# EAGLE design quad_ctl_094 (EAGLE 4.16)

## Sheet 1 of 2
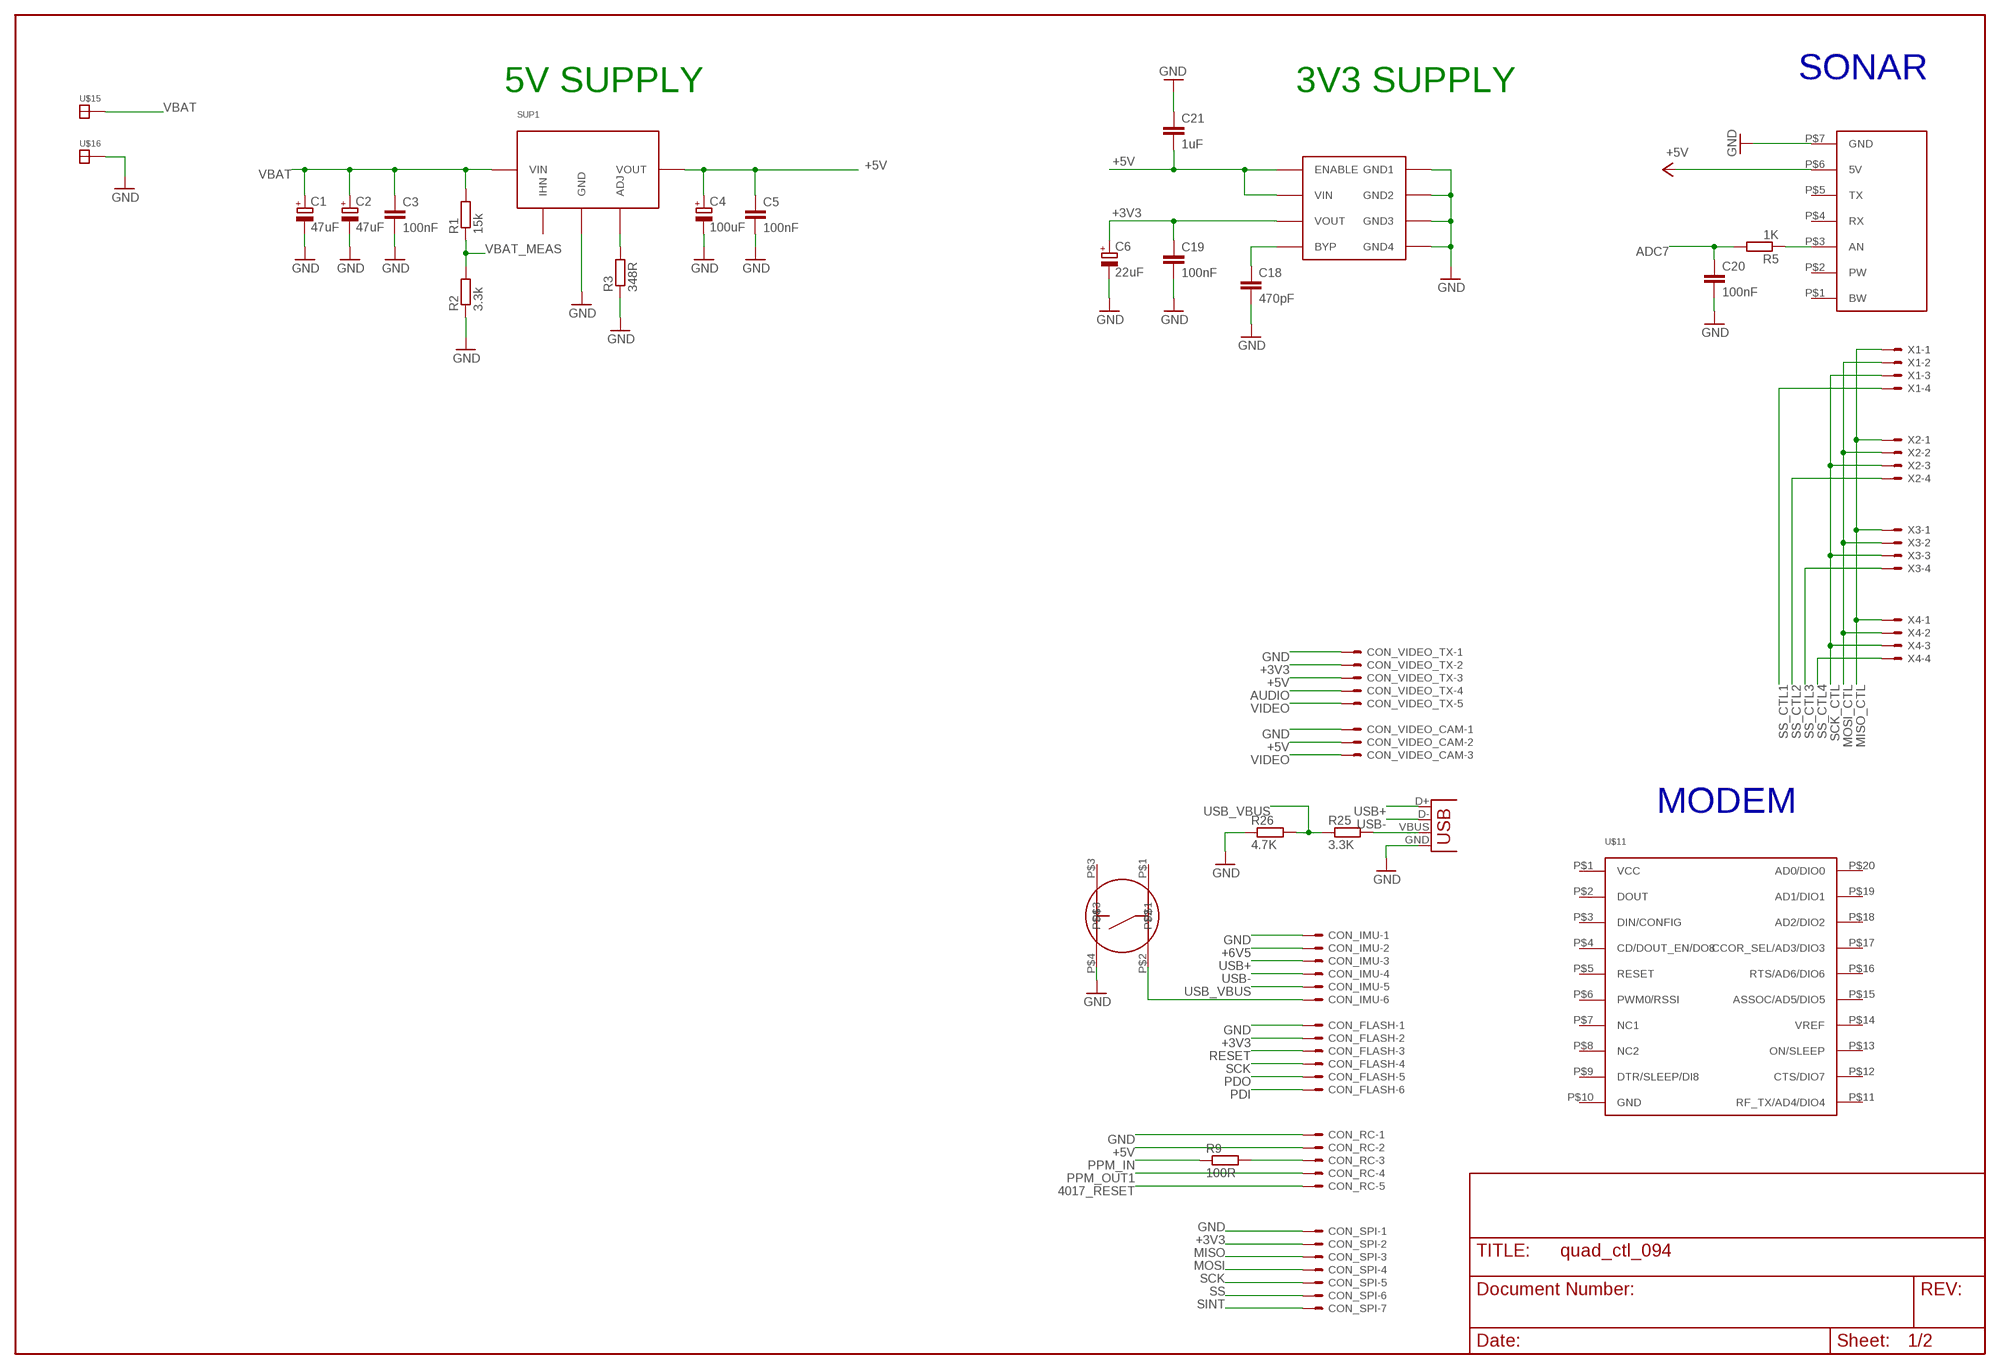
[diagram p0: schematic, sheet 1]

### Parts
C1  47uF  CPOL-EUSMCD  [SMC_D]
C2  47uF  CPOL-EUSMCD  [SMC_D]
C3  100nF  C-EUC0402K  [C0402K]
C4  100uF  CPOL-EUSMCD  [SMC_D]
C5  100nF  C-EUC0402K  [C0402K]
C6  22uF  CPOL-EUSMCB  [SMC_B]
C18  470pF  C-EUC0402K  [C0402K]
C19  100nF  C-EUC0402K  [C0402K]
C20  100nF  C-EUC0603  [C0603]
C21  1uF  C-EUC0805K  [C0805K]
CON_FLASH  53047-06  [53047-06]
CON_IMU  53047-06  [53047-06]
CON_RC  53047-05  [53047-05]
CON_SPI  53047-07  [53047-07]
CON_VIDEO_CAM  53047-03  [53047-03]
CON_VIDEO_TX  53047-05  [53047-05]
R1  15k  R-EU_R0402  [R0402]
R2  3.3k  R-EU_R0402  [R0402]
R3  348R  R-EU_R0402  [R0402]
R5  1K  R-EU_R0603  [R0603]
R9  100R  R-EU_R0603  [R0603]
R25  3.3K  R-EU_R0603  [R0603]
R26  4.7K  R-EU_R0603  [R0603]
SUP1  PTH  [PTH]
U$1  B3S  [B3S]
U$4  MIC5209  [SOIC8]
U$9  MAXSONAR  [MAXSONAR]
U$11  XBEEPRO  [XBEE]
U$15  SOLDER_PAD150_75  [SOLD_PAD_150_75]
U$16  SOLDER_PAD150_75  [SOLD_PAD_150_75]
X1  53047-04  [53047-04]
X2  53047-04  [53047-04]
X3  53047-04  [53047-04]
X4  53047-04  [53047-04]
X12  USB-MB-S  [USB-MB-S]

### Nets
4017_RESET: CON_RC.5
+3V3: C6.+ C19.1 CON_FLASH.2 CON_SPI.2 CON_VIDEO_TX.2 U$4.3(VOUT)
+5V: C4.+ C5.1 C21.2 CON_RC.2 CON_VIDEO_CAM.2 CON_VIDEO_TX.3 SUP1.P$3(VOUT) U$4.1(ENABLE) U$4.2(VIN) U$9.P$6(5V)
+6V5: CON_IMU.2
ADC7: C20.1 R5.2
AUDIO: CON_VIDEO_TX.4
GND: C1.- C2.- C3.2 C4.- C5.2 C6.- C18.2 C19.2 C20.2 C21.1 CON_FLASH.1 CON_IMU.1 CON_RC.1 CON_SPI.1 CON_VIDEO_CAM.1 CON_VIDEO_TX.1 R2.1 R3.1 R26.1 SUP1.P$2(GND) U$1.P$4 U$4.5(GND4) U$4.6(GND3) U$4.7(GND2) U$4.8(GND1) U$9.P$7(GND) U$16.P$1 X12.GND
MISO: CON_SPI.3
MISO_CTL: X1.1 X2.1 X3.1 X4.1
MOSI: CON_SPI.4
MOSI_CTL: X1.2 X2.2 X3.2 X4.2
N$5: R3.2 SUP1.P$4(ADJ)
N$6: C18.1 U$4.4(BYP)
N$7: CON_RC.3 R9.2
N$8: CON_IMU.6 U$1.P$2
N$24: R25.2 X12.VBUS
N$36: R5.1 U$9.P$3(AN)
PDI: CON_FLASH.6
PDO: CON_FLASH.5
PPM_IN: R9.1
PPM_OUT1: CON_RC.4
RESET: CON_FLASH.3
SCK: CON_FLASH.4 CON_SPI.5
SCK_CTL: X1.3 X2.3 X3.3 X4.3
SINT: CON_SPI.7
SS: CON_SPI.6
SS_CTL1: X1.4
SS_CTL2: X2.4
SS_CTL3: X3.4
SS_CTL4: X4.4
USB+: CON_IMU.3 X12.D+
USB-: CON_IMU.4 X12.D-
USB_VBUS: CON_IMU.5 R25.1 R26.2
VBAT: C1.+ C2.+ C3.1 R1.2 SUP1.P$1(VIN) U$15.P$1
VBAT_MEAS: R1.1 R2.2
VIDEO: CON_VIDEO_CAM.3 CON_VIDEO_TX.5
Unconnected: SUP1.P$5(IHN) U$1.P$1 U$1.P$3 U$9.P$1(BW) U$9.P$2(PW) U$9.P$4(RX) U$9.P$5(TX) U$11.P$1(VCC) U$11.P$2(DOUT) U$11.P$3(DIN/CONFIG) U$11.P$4(CD/DOUT_EN/DO8) U$11.P$5(RESET) U$11.P$6(PWM0/RSSI) U$11.P$7(NC1) U$11.P$8(NC2) U$11.P$9(DTR/SLEEP/DI8) U$11.P$10(GND) U$11.P$11(RF_TX/AD4/DIO4) U$11.P$12(CTS/DIO7) U$11.P$13(ON/SLEEP) U$11.P$14(VREF) U$11.P$15(ASSOC/AD5/DIO5) U$11.P$16(RTS/AD6/DIO6) U$11.P$17(CCOR_SEL/AD3/DIO3) U$11.P$18(AD2/DIO2) U$11.P$19(AD1/DIO1) U$11.P$20(AD0/DIO0)

### Notes on the sheet
- SONAR
- 5V SUPPLY | 3V3 SUPPLY
- MODEM

## Sheet 2 of 2
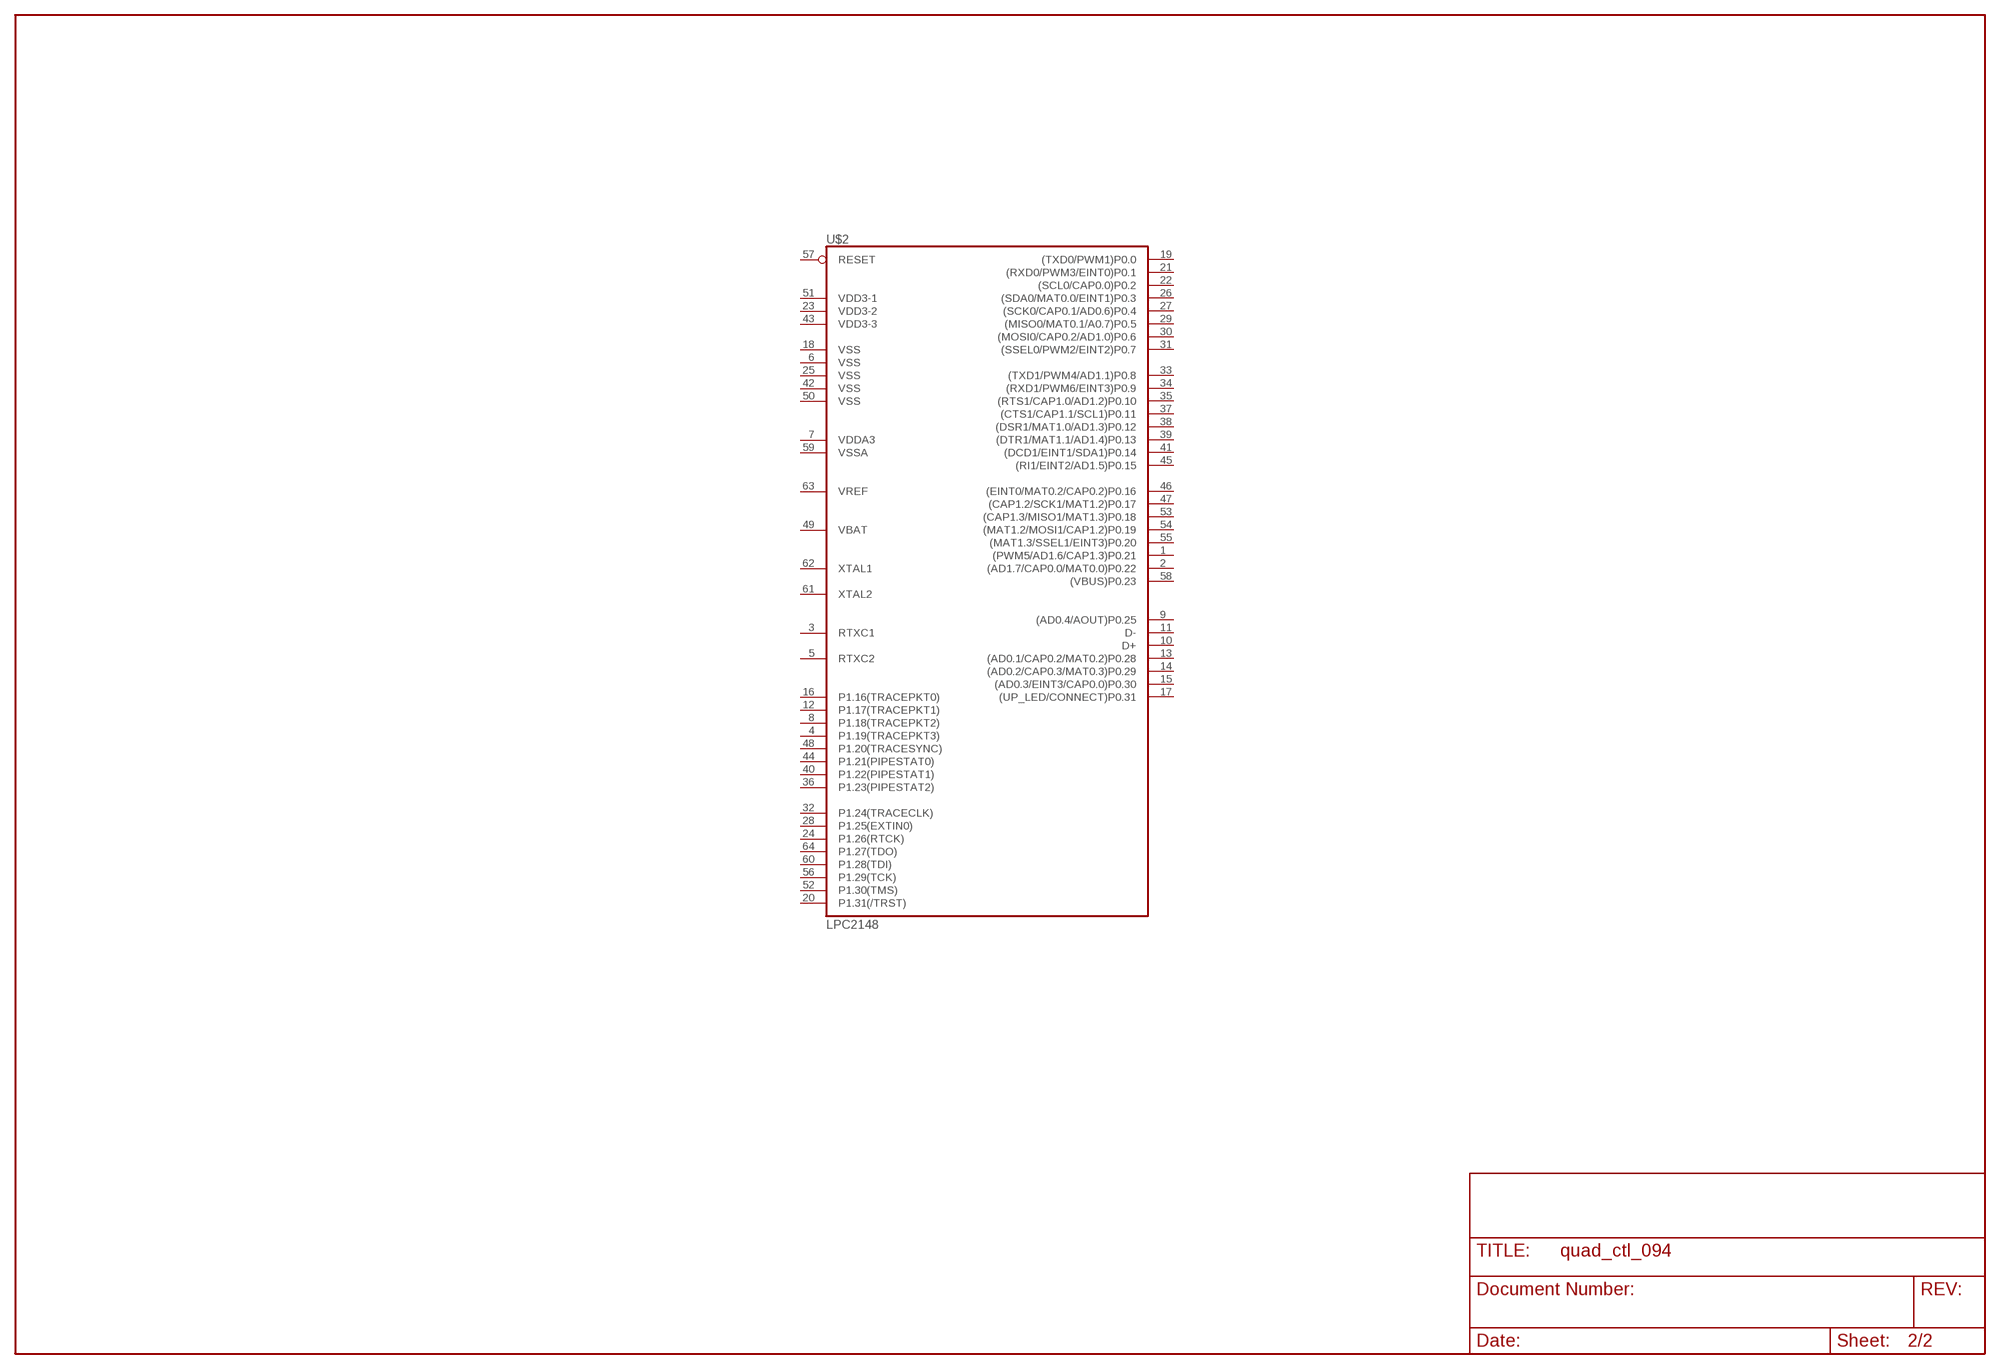
[diagram p1: schematic, sheet 2]

### Parts
U$2  LPC2148  [SQFP-S-10X10-64]
Unconnected: U$2.1((PWM5/AD1.6/CAP1.3)P0.21) U$2.2((AD1.7/CAP0.0/MAT0.0)P0.22) U$2.3(RTXC1) U$2.4(P1.19(TRACEPKT3)) U$2.5(RTXC2) U$2.8(P1.18(TRACEPKT2)) U$2.9((AD0.4/AOUT)P0.25) U$2.10(D+) U$2.11(D-) U$2.12(P1.17(TRACEPKT1)) U$2.13((AD0.1/CAP0.2/MAT0.2)P0.28) U$2.14((AD0.2/CAP0.3/MAT0.3)P0.29) U$2.15((AD0.3/EINT3/CAP0.0)P0.30) U$2.16(P1.16(TRACEPKT0)) U$2.17((UP_LED/CONNECT)P0.31) U$2.19((TXD0/PWM1)P0.0) U$2.20(P1.31(/TRST)) U$2.21((RXD0/PWM3/EINT0)P0.1) U$2.22((SCL0/CAP0.0)P0.2) U$2.24(P1.26(RTCK)) U$2.26((SDA0/MAT0.0/EINT1)P0.3) U$2.27((SCK0/CAP0.1/AD0.6)P0.4) U$2.28(P1.25(EXTIN0)) U$2.29((MISO0/MAT0.1/A0.7)P0.5) U$2.30((MOSI0/CAP0.2/AD1.0)P0.6) U$2.31((SSEL0/PWM2/EINT2)P0.7) U$2.32(P1.24(TRACECLK)) U$2.33((TXD1/PWM4/AD1.1)P0.8) U$2.34((RXD1/PWM6/EINT3)P0.9) U$2.35((RTS1/CAP1.0/AD1.2)P0.10) U$2.36(P1.23(PIPESTAT2)) U$2.37((CTS1/CAP1.1/SCL1)P0.11) U$2.38((DSR1/MAT1.0/AD1.3)P0.12) U$2.39((DTR1/MAT1.1/AD1.4)P0.13) U$2.40(P1.22(PIPESTAT1)) U$2.41((DCD1/EINT1/SDA1)P0.14) U$2.44(P1.21(PIPESTAT0)) U$2.45((RI1/EINT2/AD1.5)P0.15) U$2.46((EINT0/MAT0.2/CAP0.2)P0.16) U$2.47((CAP1.2/SCK1/MAT1.2)P0.17) U$2.48(P1.20(TRACESYNC)) U$2.52(P1.30(TMS)) U$2.53((CAP1.3/MISO1/MAT1.3)P0.18) U$2.54((MAT1.2/MOSI1/CAP1.2)P0.19) U$2.55((MAT1.3/SSEL1/EINT3)P0.20) U$2.56(P1.29(TCK)) U$2.57(RESET) U$2.58((VBUS)P0.23) U$2.60(P1.28(TDI)) U$2.61(XTAL2) U$2.62(XTAL1) U$2.63(VREF) U$2.64(P1.27(TDO))

## Power pins joined to a net without a drawn wire
VBAT: U$2.49(VBAT)
VDD3-1: U$2.51(VDD3-1)
VDD3-2: U$2.23(VDD3-2)
VDD3-3: U$2.43(VDD3-3)
VDDA3: U$2.7(VDDA3)
VSS: U$2.6(VSS) U$2.18(VSS) U$2.25(VSS) U$2.42(VSS) U$2.50(VSS)
VSSA: U$2.59(VSSA)

## Library data of the parts
C1 C2 C4 C6 = rcl:CPOL-EU: POLARIZED CAPACITOR, European symbol
C3 C5 C18-C21 = rcl:C-EU: CAPACITOR, European symbol
CON_FLASH CON_IMU = con-molex:53?-06: CONNECTOR wire to board 1.25 mm (.049 inch) pitch header
CON_RC CON_VIDEO_TX = con-molex:53?-05: CONNECTOR wire to board 1.25 mm (.049 inch) pitch header
CON_SPI = con-molex:53?-07: CONNECTOR wire to board 1.25 mm (.049 inch) pitch header
CON_VIDEO_CAM = con-molex:53?-03: CONNECTOR wire to board 1.25 mm (.049 inch) pitch header
R1-R3 R5 R9 R25 R26 = rcl:R-EU_: RESISTOR, European symbol
SUP1 = paparazzi:PTH
U$1 = paparazzi:B3S
U$2 = paparazzi:LPC2148
U$4 = paparazzi:MIC5209
U$9 = paparazzi:MAXSONAR
U$11 = paparazzi:XBEEPRO
U$15 U$16 = paparazzi:SOLDER_PAD
X1-X4 = con-molex:53?-04: CONNECTOR wire to board 1.25 mm (.049 inch) pitch header
X12 = con-usb:USB: USB Connectors

## Board
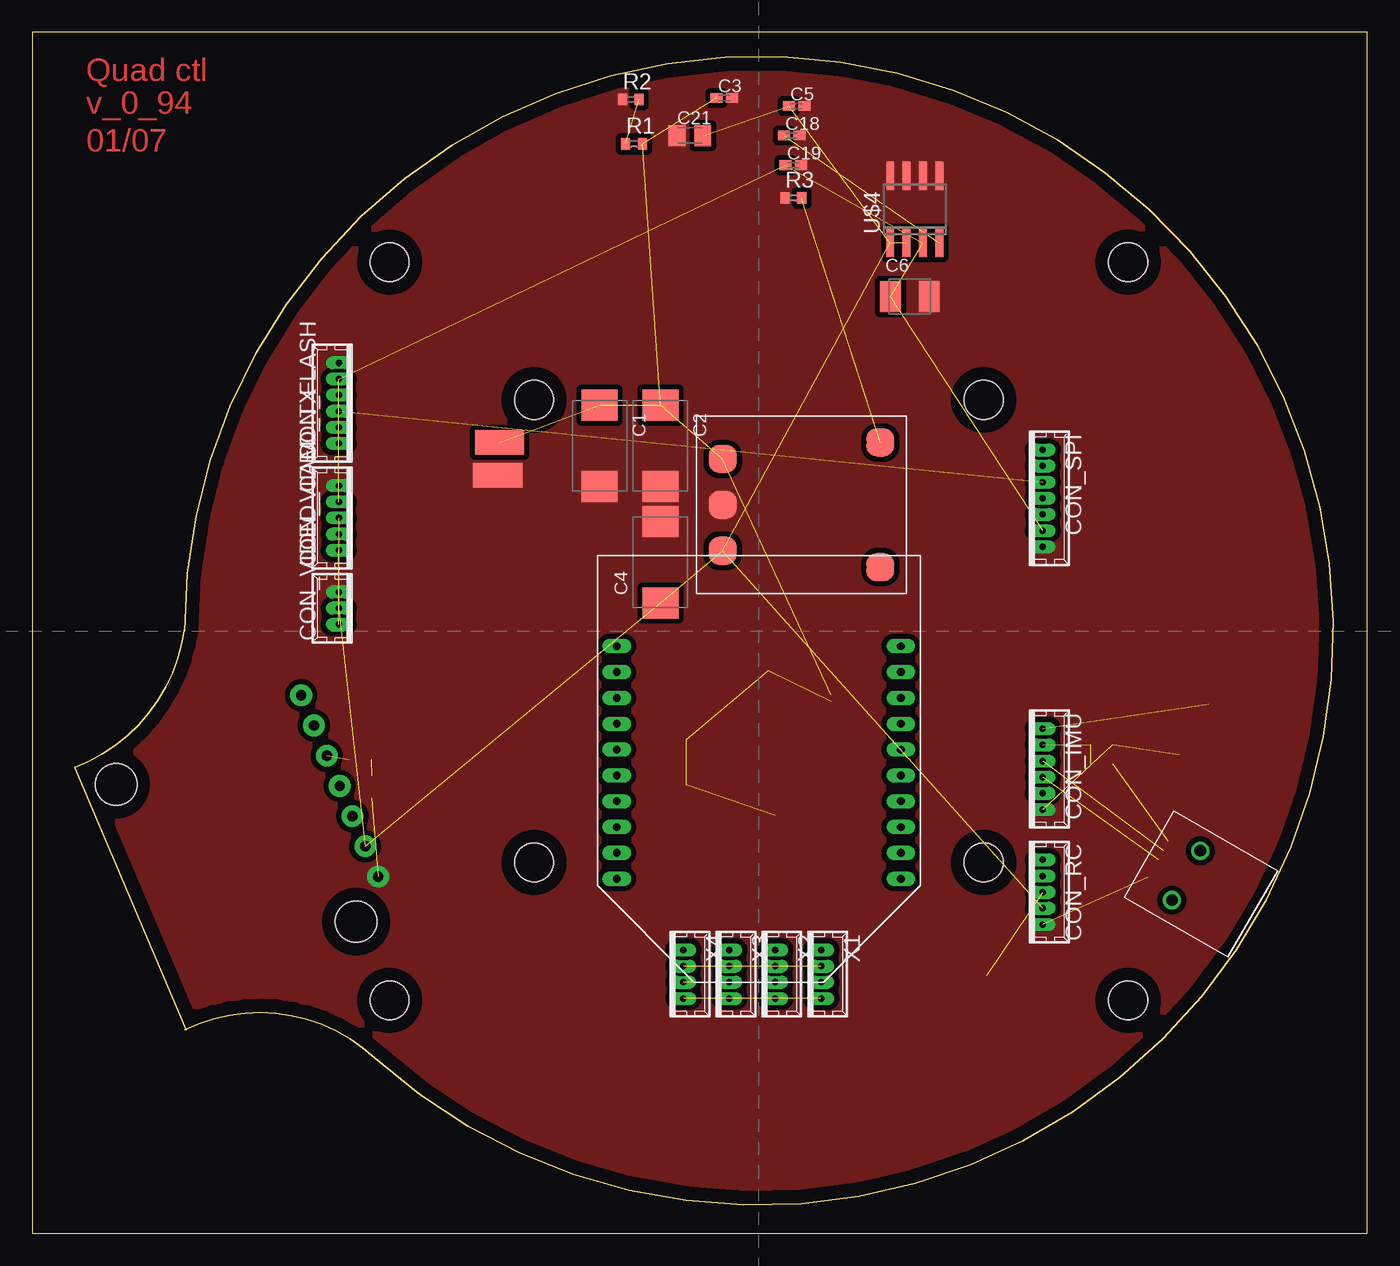
[diagram p2: board, top side]
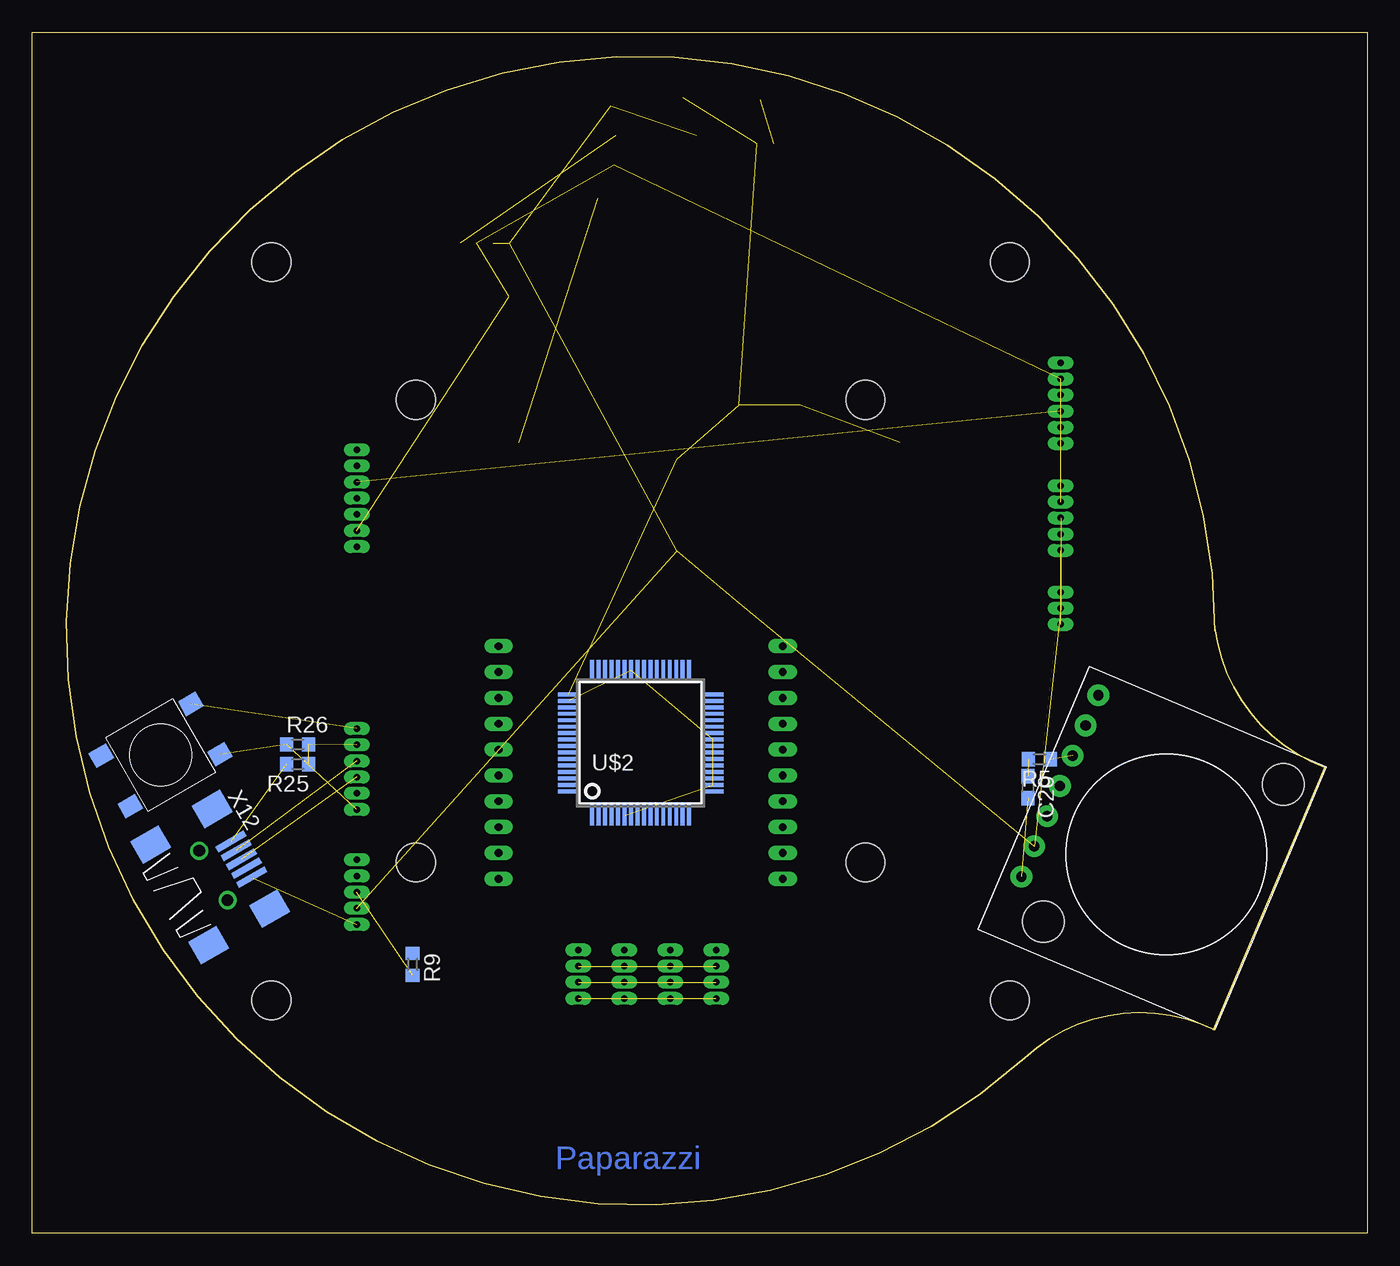
[diagram p3: board, bottom side, seen from below]

Size 103.3 x 92.95 mm. Coordinates in mm from the lower left corner, seen from the top.
Outline: 11.77,15.74 arc-69 26.51,13.58 arc312 11.77,46.6
Outline: 11.77,46.86 arc-62 3.26,36.06 11.9,15.74
Outline: 0,0 103.3,0 103.3,92.95 0,92.95 0,0
Copper layers (1*16): Top 0.035mm / dielectric 1.5mm / Bottom 0.035mm
Design rules "default": minimum track width 10mil, minimum drill 24mil, track to track 8mil, track to pad 8mil, pad to pad 8mil, via to via 8mil, smd to smd 8mil, copper to edge 40mil, drill to drill 8mil, minimum pad ring 10mil, minimum via ring 8mil, stop-mask expansion 4mil, vias tented up to drill 0mil, thermal gap 10mil
Holes 3 mm at 27.65,75.18 84.8,75.18 84.8,18.03 27.65,18.03 38.82,64.51 73.62,64.51 73.62,28.7 38.82,28.7

### Footprints (pad centres in the part's own frame; a part is rotated, then mirrored left to right if it is on the bottom)
SMC_D = smd 2.4 x 2.8: + -3.15,0; - 3.15,0
C0402K = smd 0.925 x 0.74: 1 -0.6,0; 2 0.6,0
SMC_B = smd 1.6 x 2.4: + -1.5,0; - 1.5,0
C0603 = smd 1.1 x 1: 1 -0.85,0; 2 0.85,0
C0805K = smd 1.3 x 1.6: 1 -1,0; 2 1,0
53047-06 = drill 0.5 pad 0.698 long: 1 3.125,0; 2 1.875,0; 3 0.625,0; 4 -0.625,0; 5 -1.875,0; 6 -3.125,0
53047-05 = drill 0.5 pad 0.698 long: 1 2.5,0; 2 1.25,0; 3 0,0; 4 -1.25,0; 5 -2.5,0
53047-07 = drill 0.5 pad 0.698 long: 1 3.75,0; 2 2.5,0; 3 1.25,0; 4 0,0; 5 -1.25,0; 6 -2.5,0; 7 -3.75,0
53047-03 = drill 0.5 pad 0.698 long: 1 1.25,0; 2 0,0; 3 -1.25,0
R0402 = smd 0.7 x 0.9: 1 -0.65,0; 2 0.65,0
R0603 = smd 1 x 1.1: 1 -0.85,0; 2 0.85,0
PTH = smd 2.184 x 2.184: P$1 -6.096,3.556; P$2 -6.096,0; P$3 -6.096,-3.556; P$4 6.096,4.826; P$5 6.096,-4.826
B3S = smd 1.55 x 1.3: P$1 4,-2.25; P$2 -4,-2.25; P$3 4,2.25; P$4 -4,2.25
SQFP-S-10X10-64 = smd 0.3 x 1.6: 1 -3.75,-5.6; 2 -3.25,-5.6; 3 -2.75,-5.6; 4 -2.25,-5.6; 5 -1.75,-5.6; 6 -1.25,-5.6; 7 -0.75,-5.6; 8 -0.25,-5.6; 9 0.25,-5.6; 10 0.75,-5.6; 11 1.25,-5.6; 12 1.75,-5.6; 13 2.25,-5.6; 14 2.75,-5.6; 15 3.25,-5.6; 16 3.75,-5.6; 33 3.75,5.6; 34 3.25,5.6; 35 2.75,5.6; 36 2.25,5.6; 37 1.75,5.6; 38 1.25,5.6; 39 0.75,5.6; 40 0.25,5.6; 41 -0.25,5.6; 42 -0.75,5.6; 43 -1.25,5.6; 44 -1.75,5.6; 45 -2.25,5.6; 46 -2.75,5.6; 47 -3.25,5.6; 48 -3.75,5.6 | smd 1.6 x 0.3: 17 5.6,-3.75; 18 5.6,-3.25; 19 5.6,-2.75; 20 5.6,-2.25; 21 5.6,-1.75; 22 5.6,-1.25; 23 5.6,-0.75; 24 5.6,-0.25; 25 5.6,0.25; 26 5.6,0.75; 27 5.6,1.25; 28 5.6,1.75; 29 5.6,2.25; 30 5.6,2.75; 31 5.6,3.25; 32 5.6,3.75; 49 -5.6,3.75; 50 -5.6,3.25; 51 -5.6,2.75; 52 -5.6,2.25; 53 -5.6,1.75; 54 -5.6,1.25; 55 -5.6,0.75; 56 -5.6,0.25; 57 -5.6,-0.25; 58 -5.6,-0.75; 59 -5.6,-1.25; 60 -5.6,-1.75; 61 -5.6,-2.25; 62 -5.6,-2.75; 63 -5.6,-3.25; 64 -5.6,-3.75
SOIC8 = smd 0.6 x 2.2: 1 -1.905,-2.6; 2 -0.635,-2.6; 3 0.635,-2.6; 4 1.905,-2.6; 5 1.905,2.6; 6 0.635,2.6; 7 -0.635,2.6; 8 -1.905,2.6
MAXSONAR = drill 0.8 pad 1.676 round: P$1 18.415,1.778; P$2 18.415,4.318; P$3 18.415,6.858; P$4 18.415,9.398; P$5 18.415,11.938; P$6 18.415,14.478; P$7 18.415,17.018 | hole 3.2: 2.54,2.54; 15.494,19.558
XBEE = drill 0.6 long: P$1 -11,9; P$2 -11,7; P$3 -11,5; P$4 -11,3; P$5 -11,1; P$6 -11,-1; P$7 -11,-3; P$8 -11,-5; P$9 -11,-7; P$10 -11,-9; P$11 11,-9; P$12 11,-7; P$13 11,-5; P$14 11,-3; P$15 11,-1; P$16 11,1; P$17 11,3; P$18 11,5; P$19 11,7; P$20 11,9
SOLD_PAD_150_75 = smd 3.81 x 1.905: P$1 0,0
53047-04 = drill 0.5 pad 0.698 long: 1 1.875,0; 2 0.625,0; 3 -0.625,0; 4 -1.875,0
USB-MB-S = smd 2.5 x 0.5: D+ 2.5,0; D- 2.5,0.8; GND 2.5,-1.6; ID 2.5,-0.8; VBUS 2.5,1.6 | smd 2.5 x 2: P$1 -3,-4.5; P$2 -3,4.5; P$3 2.5,-4.4; P$4 2.5,4.5 | drill 0.9 round: P$5 0,2.2; P$6 0,-2.2

### Placement (x,y rotation side)
C1  43.9,60.95 270 top
C2  48.6,60.95 270 top
C3  53.56,87.88 0 top
C4  48.6,51.94 90 top
C5  59.14,87.24 0 top
C6  67.91,72.51 0 top
C18  58.76,84.96 0 top
C19  58.89,82.67 0 top
C20  26.25,34.54 270 bottom
C21  50.89,84.96 0 top
CON_FLASH  23.71,64.26 90 top
CON_IMU  78.19,35.94 270 top
CON_RC  78.19,26.41 270 top
CON_SPI  78.19,56.89 270 top
CON_VIDEO_CAM  23.71,48.38 90 top
CON_VIDEO_TX  23.71,55.37 90 top
R1  46.57,84.32 0 top
R2  46.32,87.75 0 top
R3  58.89,80.13 0 top
R5  25.36,36.7 180 bottom
R9  73.88,20.82 270 bottom
R25  82.77,36.32 180 bottom
R26  82.77,37.84 0 bottom
SUP1  59.52,56.38 0 top
U$1  93.37,37.03 210 bottom
U$2  56.22,37.97 0 bottom
U$4  68.29,79.24 0 top
U$9  3.16,36.09 157 bottom
U$11  56.22,36.44 180 top
U$15  36.16,61.21 0 top
U$16  36.03,58.67 0 top
X1  61.05,20.06 270 top
X2  57.49,20.06 270 top
X3  53.94,20.06 270 top
X4  50.38,20.06 270 top
X12  89.29,27.7 30 bottom

### Tracks (layer width: path | path; a pad name or v marks a point on that pad's centre or on a via)
+3V3  (5 unrouted)
+5V  (9 unrouted)
ADC7  (1 unrouted)
GND  (4 unrouted)
  pour Top (isolate 0.406, no thermals): 1.1,92.07 102.32,92.07 102.32,0.88 1.1,0.88
MISO_CTL  (3 unrouted)
MOSI_CTL  (3 unrouted)
N$5  (1 unrouted)
N$6  (1 unrouted)
N$7  (1 unrouted)
N$8  (1 unrouted)
N$24  (1 unrouted)
N$30  (via drill 0.6 pad 1.68)
  other vias: 84.8,75.18
N$31  (via drill 0.6 pad 1.68)
  other vias: 73.62,64.51
N$34  (via drill 0.6 pad 1.68)
  other vias: 38.82,64.51
N$35  (via drill 0.6 pad 1.68)
  other vias: 27.65,75.18
N$36  (1 unrouted)
N$37  (via drill 0.6 pad 1.68)
  other vias: 38.82,28.7
N$38  (via drill 0.6 pad 1.68)
  other vias: 27.65,18.03
N$39  (via drill 0.6 pad 1.68)
  other vias: 25.11,24.12
N$40  (via drill 0.6 pad 1.68)
  other vias: 6.44,34.67
N$41  (via drill 0.6 pad 1.68)
  other vias: 73.62,28.7
N$42  (via drill 0.6 pad 1.68)
  other vias: 84.8,18.03
SCK  (1 unrouted)
SCK_CTL  (3 unrouted)
USB+  (1 unrouted)
USB-  (1 unrouted)
USB_VBUS  (2 unrouted)
VBAT  (6 unrouted)
VBAT_MEAS  (1 unrouted)
VIDEO  (1 unrouted)
VSS  (4 unrouted)

### Text on the board
Top: Quad ctl | v_0_94 | 01/07
Bottom: Paparazzi